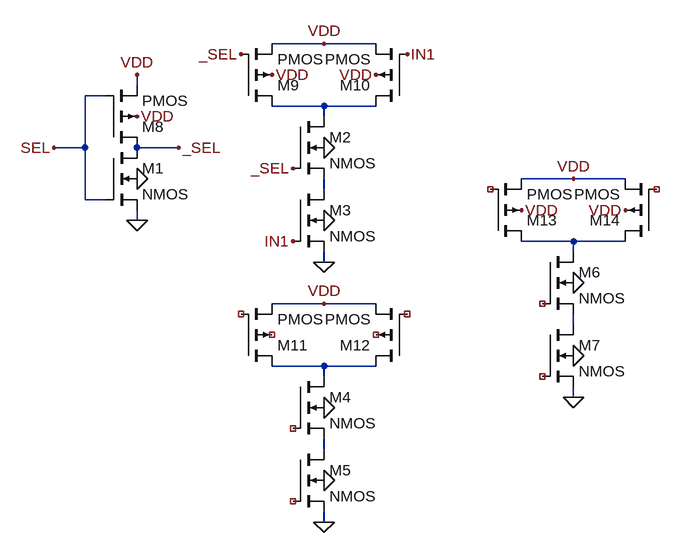
[diagram p0: schematic Draft3.asc]
Draft3.asc, the LTspice schematic file:
Version 4
SHEET 1 960 680
WIRE 416 -80 336 -80
WIRE 496 -80 416 -80
WIRE 128 -16 128 -32
WIRE 80 0 48 0
WIRE 416 16 336 16
WIRE 496 16 416 16
WIRE 416 32 416 16
WIRE 48 80 48 0
WIRE 48 80 0 80
WIRE 192 80 128 80
WIRE 800 128 720 128
WIRE 880 128 800 128
WIRE 416 144 416 128
WIRE 48 160 48 80
WIRE 80 160 48 160
WIRE 128 192 128 176
WIRE 800 224 720 224
WIRE 880 224 800 224
WIRE 800 240 800 224
WIRE 416 256 416 240
WIRE 416 320 336 320
WIRE 496 320 416 320
WIRE 800 352 800 336
WIRE 416 416 336 416
WIRE 496 416 416 416
WIRE 416 432 416 416
WIRE 800 464 800 448
WIRE 416 544 416 528
WIRE 416 656 416 640
FLAG 800 464 0
FLAG 800 400 0
FLAG 800 288 0
FLAG 416 80 0
FLAG 416 192 0
FLAG 416 256 0
FLAG 416 480 0
FLAG 416 592 0
FLAG 416 656 0
FLAG 128 192 0
FLAG 128 128 0
FLAG 128 32 VDD
FLAG 128 -32 VDD
FLAG 336 -32 VDD
FLAG 496 -32 VDD
FLAG 416 -80 VDD
FLAG 416 320 VDD
FLAG 800 128 VDD
FLAG 720 176 VDD
FLAG 880 176 VDD
FLAG 0 80 SEL
FLAG 192 80 _SEL
FLAG 288 -64 _SEL
FLAG 368 112 _SEL
FLAG 544 -64 IN1
FLAG 368 224 IN1
SYMBOL nmos4 80 80 R0
SYMATTR InstName M1
SYMBOL nmos4 368 32 R0
SYMATTR InstName M2
SYMBOL nmos4 368 144 R0
SYMATTR InstName M3
SYMBOL nmos4 368 432 R0
SYMATTR InstName M4
SYMBOL nmos4 368 544 R0
SYMATTR InstName M5
SYMBOL nmos4 752 240 R0
SYMATTR InstName M6
SYMBOL nmos4 752 352 R0
SYMATTR InstName M7
SYMBOL pmos4 80 80 M180
SYMATTR InstName M8
SYMBOL pmos4 288 16 M180
SYMATTR InstName M9
SYMBOL pmos4 544 16 R180
SYMATTR InstName M10
SYMBOL pmos4 288 416 M180
SYMATTR InstName M11
SYMBOL pmos4 544 416 R180
SYMATTR InstName M12
SYMBOL pmos4 672 224 M180
SYMATTR InstName M13
SYMBOL pmos4 928 224 R180
SYMATTR InstName M14

The netlist it stands for:
* Draft3.asc
M1 _SEL SEL 0 0 NMOS
M2 N001 _SEL N002 0 NMOS
M3 N002 IN1 0 0 NMOS
M4 N005 NC_01 N006 0 NMOS
M5 N006 NC_02 0 0 NMOS
M6 N003 NC_03 N004 0 NMOS
M7 N004 NC_04 0 0 NMOS
M8 _SEL SEL VDD VDD PMOS
M9 N001 _SEL VDD VDD PMOS
M10 N001 IN1 VDD VDD PMOS
M11 N005 NC_05 VDD NC_06 PMOS
M12 N005 NC_07 VDD NC_08 PMOS
M13 N003 NC_09 VDD VDD PMOS
M14 N003 NC_10 VDD VDD PMOS
.model NMOS NMOS
.model PMOS PMOS
.lib standard.mos
.backanno
.end